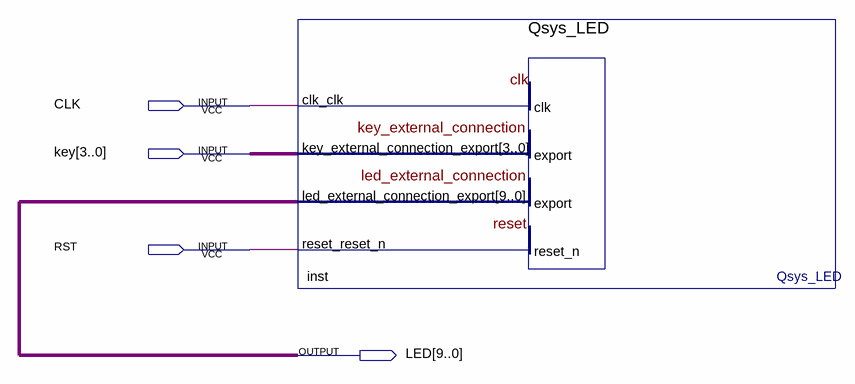
[diagram p0: schematic sheet]
// Quartus schematic LED.bdf as structural Verilog: 1 symbols, 4 pins
module LED (
  input  CLK,
  input  [3:0] key,
  input  RST,
  output [9:0] LED
);

  Qsys_LED inst (
    .clk_clk(CLK), .key_external_connection_export(key), .reset_reset_n(RST),
    .led_external_connection_export(LED));
endmodule
